# Altium schematic sheet V1.1.SchDoc
size 50 x 55 mm
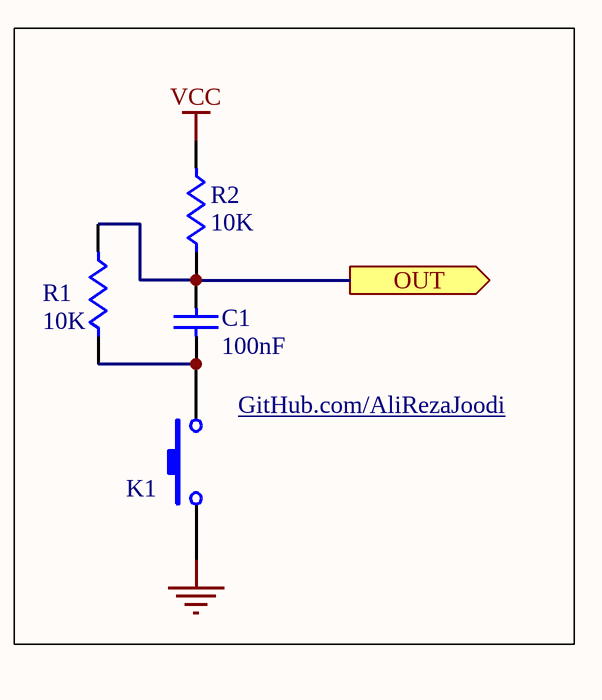
[diagram p0: V1.1.SchDoc]

## Parts
C1  100nF  [CAPNTO2.54-3.56x2.03]
K1  SW-PB  [SPST-2_2]  (value not drawn)
R1  10K  [AXIAL-0.4]
R2  10K  [AXIAL-0.4]

## Ports
OUT (out)

## Nets
GND: K1.1
VCC: R2.2
OUT: C1.1 R1.2 R2.1 ; port OUT
NetC1_2: C1.2 K1.2 R1.1

## Notes on the sheet
- GitHub.com/AliRezaJoodi

## Library data of the parts
C1 = Cap: Capacitor; Manufacturer: Generic Components; Class I: Passive; Published: 8-Jun-2000; Revision: July-2002: Re-released for DXP Platform.; Publisher: Altium Limited; Class II: Capacitor
K1 = SW-PB: Switch; Manufacturer: Generic Components; Published: 24-Mar-1999; Revision: July-2002: Re-released for DXP Platform.; Publisher: Altium Limited
R1 R2 = Res1: Resistor; Manufacturer: Generic Components; Class I: Passive; Published: 8-Jun-2000; Revision: July-2002: Re-released for DXP Platform.; Publisher: Altium Limited; Class II: Resistor